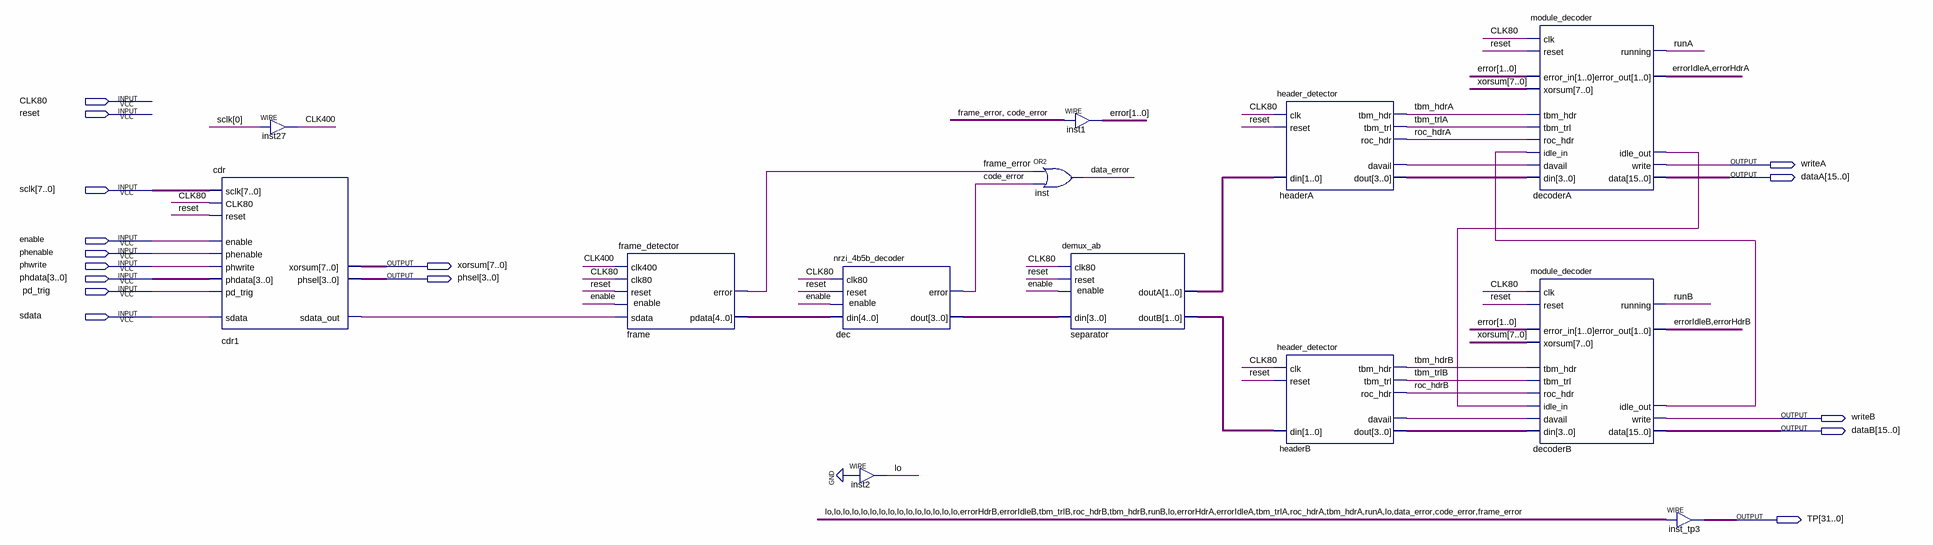
[diagram p0: schematic sheet]
// Quartus schematic deser400_PSI.bdf as structural Verilog: 13 symbols, 16 pins
module deser400_PSI (
  input  CLK80,
  input  reset,
  input  [7:0] sclk,
  input  enable,
  input  phenable,
  input  phwrite,
  input  [3:0] phdata,
  input  pd_trig,
  input  sdata,
  output writeA,
  output [15:0] dataA,
  output [7:0] xorsum,
  output [3:0] phsel,
  output writeB,
  output [15:0] dataB,
  output [31:0] TP
);

  wire cdr1_sdata_out, CLK400, code_error, data_error, decoderA_idle_out, decoderB_idle_out, errorHdrA,
       errorHdrB, errorIdleA, errorIdleB, frame_error, headerA_davail, headerB_davail, lo, roc_hdrA,
       roc_hdrB, runA, runB, tbm_hdrA, tbm_hdrB, tbm_trlA, tbm_trlB;
  wire [1:0] error, separator_douta, separator_doutb;
  wire [3:0] dec_dout, headerA_dout, headerB_dout;
  wire [4:0] frame_pdata;

  cdr cdr1 (
    .sclk(sclk), .CLK80(CLK80), .reset(reset), .sdata(sdata), .enable(enable), .phenable(phenable),
    .phwrite(phwrite), .phdata(phdata), .pd_trig(pd_trig), .sdata_out(cdr1_sdata_out), .xorsum(xorsum),
    .phsel(phsel));
  assign CLK400 = sclk[0];  // WIRE inst27
  frame_detector frame (
    .clk400(CLK400), .clk80(CLK80), .reset(reset), .sdata(cdr1_sdata_out), .enable(enable),
    .pdata(frame_pdata), .error(frame_error));
  nrzi_4b5b_decoder dec (
    .clk80(CLK80), .reset(reset), .din(frame_pdata), .enable(enable), .dout(dec_dout), .error(code_error));
  assign lo = 1'b0;  // WIRE inst2
  assign error = {frame_error, code_error};  // WIRE inst1
  or inst (data_error, frame_error, code_error);
  demux_ab separator (
    .clk80(CLK80), .reset(reset), .din(dec_dout), .enable(enable), .doutA(separator_douta),
    .doutB(separator_doutb));
  header_detector headerA (
    .clk(CLK80), .reset(reset), .din(separator_douta), .davail(headerA_davail), .dout(headerA_dout),
    .tbm_hdr(tbm_hdrA), .tbm_trl(tbm_trlA), .roc_hdr(roc_hdrA));
  header_detector headerB (
    .clk(CLK80), .reset(reset), .din(separator_doutb), .davail(headerB_davail), .dout(headerB_dout),
    .tbm_hdr(tbm_hdrB), .tbm_trl(tbm_trlB), .roc_hdr(roc_hdrB));
  module_decoder decoderA (
    .clk(CLK80), .reset(reset), .davail(headerA_davail), .din(headerA_dout), .tbm_hdr(tbm_hdrA),
    .tbm_trl(tbm_trlA), .roc_hdr(roc_hdrA), .idle_in(decoderB_idle_out), .xorsum(xorsum), .error_in(error),
    .idle_out(decoderA_idle_out), .running(runA), .error_out({errorIdleA, errorHdrA}), .write(writeA),
    .data(dataA));
  module_decoder decoderB (
    .clk(CLK80), .reset(reset), .davail(headerB_davail), .din(headerB_dout), .tbm_hdr(tbm_hdrB),
    .tbm_trl(tbm_trlB), .roc_hdr(roc_hdrB), .idle_in(decoderA_idle_out), .xorsum(xorsum), .error_in(error),
    .idle_out(decoderB_idle_out), .running(runB), .error_out({errorIdleB, errorHdrB}), .write(writeB),
    .data(dataB));
  assign TP = {{15{lo}}, errorHdrB, errorIdleB, tbm_trlB, roc_hdrB, tbm_hdrB, runB, lo, errorHdrA, errorIdleA, tbm_trlA, roc_hdrA, tbm_hdrA, runA, lo, data_error, code_error, frame_error};  // WIRE inst_tp3
endmodule
